# Altium schematic sheet RPI-CM3.SchDoc: PRI-CM-3
size 558 x 431 mm
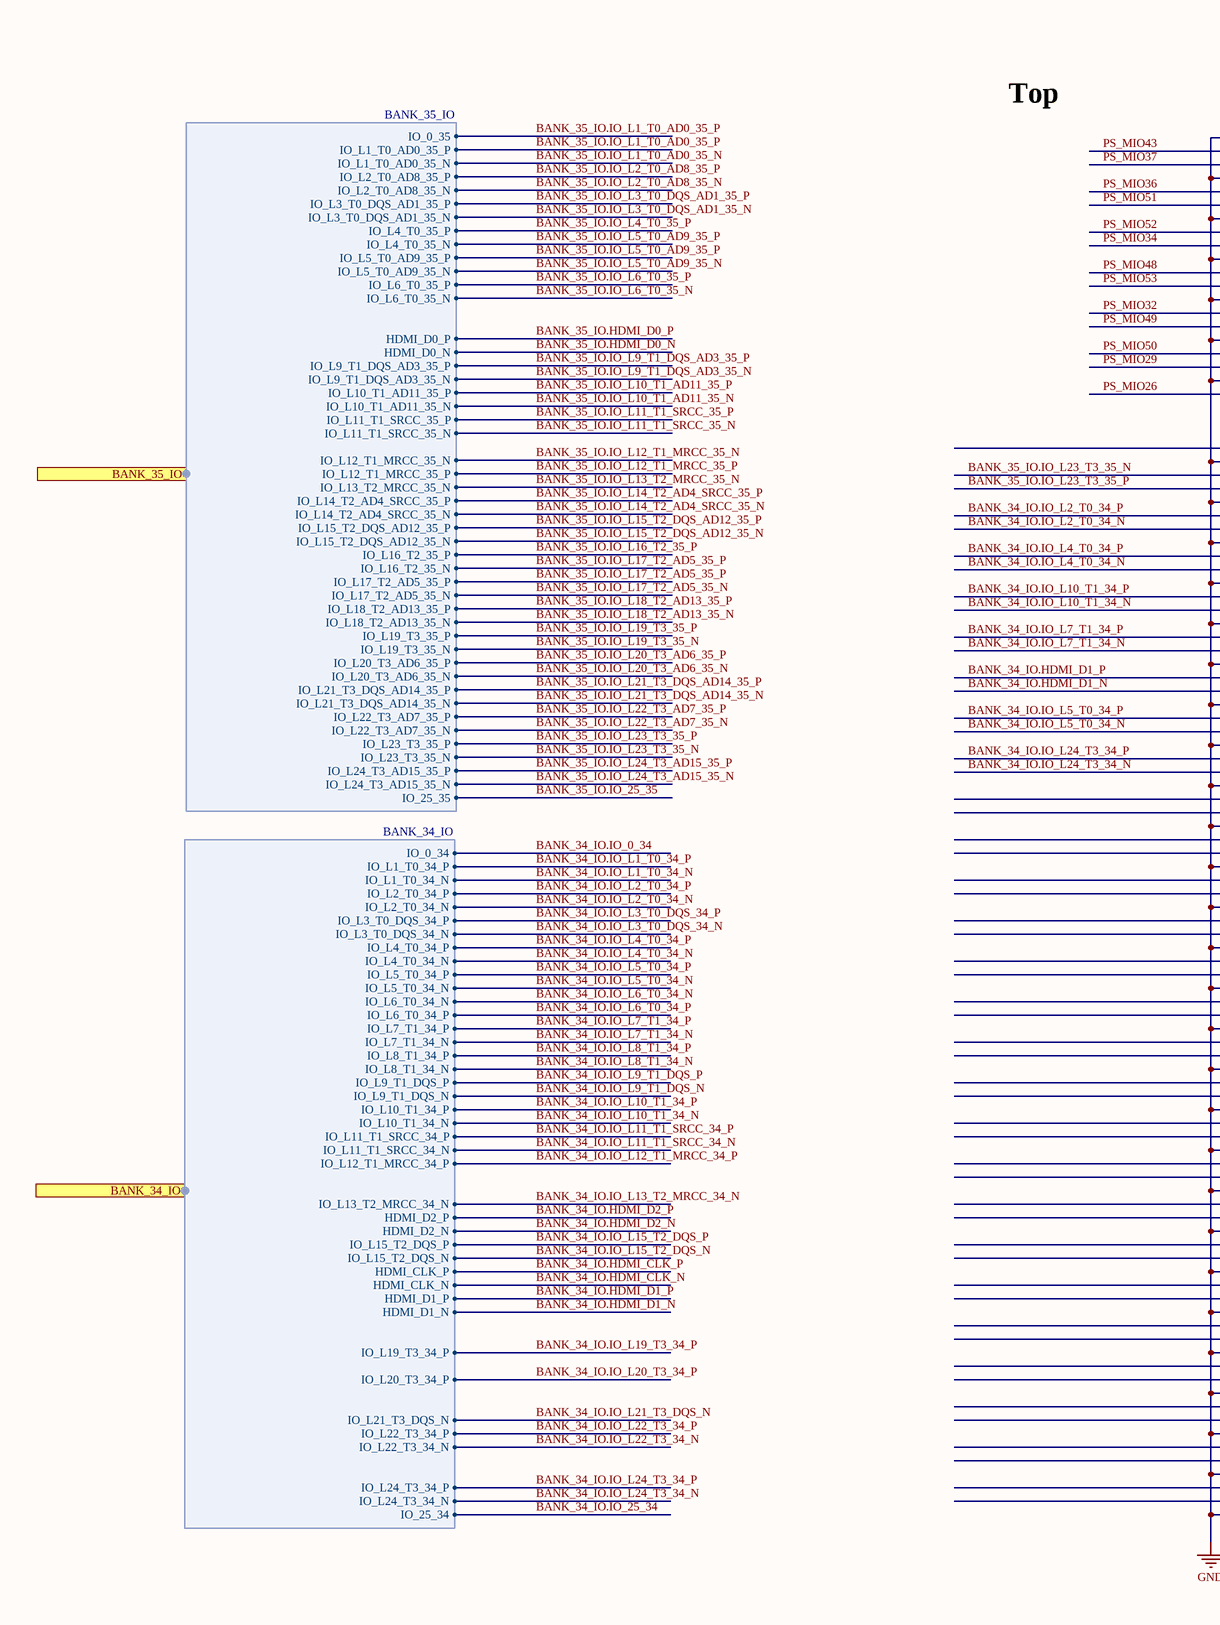
[diagram p0: RPI-CM3.SchDoc, left]
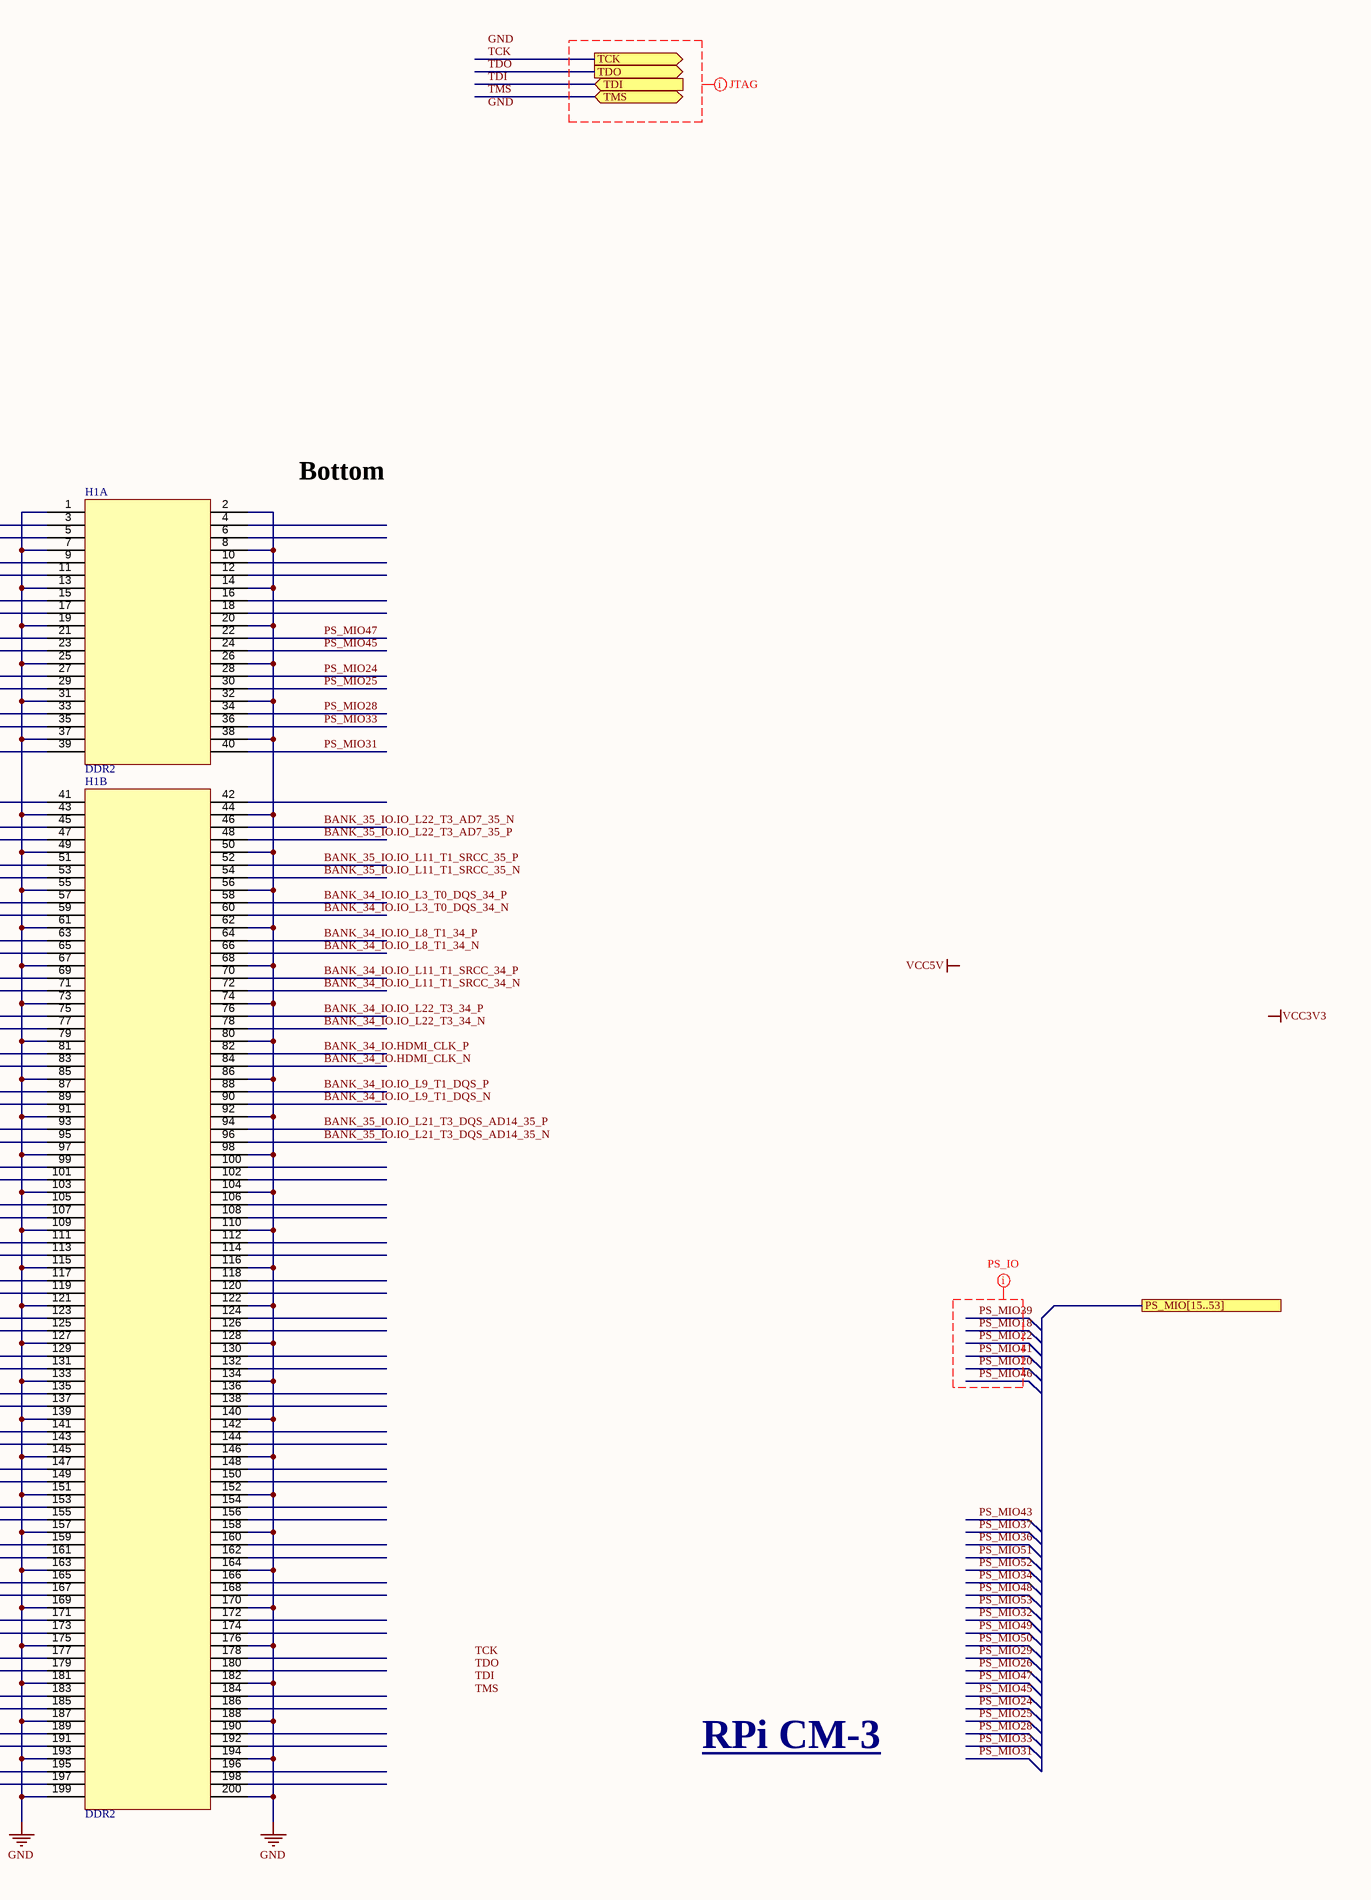
[diagram p1: RPI-CM3.SchDoc, right]

## Parts
H1  DDR2  [DDR2-SO-DIMM]  (parts A,B of 2)  (no BOM)

## Ports
BANK_34_IO (harness BANK_34_IO), BANK_35_IO (harness BANK_35_IO), PS_MIO[15..53], TCK (out), TDI (in), TDO (out), TMS (bidir)

## Harnesses
BANK_35_IO: IO_0_35, IO_L1_T0_AD0_35_P, IO_L1_T0_AD0_35_N, IO_L2_T0_AD8_35_P, IO_L2_T0_AD8_35_N, IO_L3_T0_DQS_AD1_35_P, IO_L3_T0_DQS_AD1_35_N, IO_L4_T0_35_P, IO_L4_T0_35_N, IO_L5_T0_AD9_35_P, IO_L5_T0_AD9_35_N, IO_L6_T0_35_P, IO_L6_T0_35_N, HDMI_D0_P, HDMI_D0_N, IO_L9_T1_DQS_AD3_35_P, IO_L9_T1_DQS_AD3_35_N, IO_L10_T1_AD11_35_P, IO_L10_T1_AD11_35_N, IO_L11_T1_SRCC_35_P, IO_L11_T1_SRCC_35_N, IO_L12_T1_MRCC_35_N, IO_L12_T1_MRCC_35_P, IO_L13_T2_MRCC_35_N, IO_L14_T2_AD4_SRCC_35_P, IO_L14_T2_AD4_SRCC_35_N, IO_L15_T2_DQS_AD12_35_P, IO_L15_T2_DQS_AD12_35_N, IO_L16_T2_35_P, IO_L16_T2_35_N, IO_L17_T2_AD5_35_P, IO_L17_T2_AD5_35_N, IO_L18_T2_AD13_35_P, IO_L18_T2_AD13_35_N, IO_L19_T3_35_P, IO_L19_T3_35_N, IO_L20_T3_AD6_35_P, IO_L20_T3_AD6_35_N, IO_L21_T3_DQS_AD14_35_P, IO_L21_T3_DQS_AD14_35_N, IO_L22_T3_AD7_35_P, IO_L22_T3_AD7_35_N, IO_L23_T3_35_P, IO_L23_T3_35_N, IO_L24_T3_AD15_35_P, IO_L24_T3_AD15_35_N, IO_25_35
BANK_34_IO: IO_0_34, IO_L1_T0_34_P, IO_L1_T0_34_N, IO_L2_T0_34_P, IO_L2_T0_34_N, IO_L3_T0_DQS_34_P, IO_L3_T0_DQS_34_N, IO_L4_T0_34_P, IO_L4_T0_34_N, IO_L5_T0_34_P, IO_L5_T0_34_N, IO_L6_T0_34_N, IO_L6_T0_34_P, IO_L7_T1_34_P, IO_L7_T1_34_N, IO_L8_T1_34_P, IO_L8_T1_34_N, IO_L9_T1_DQS_P, IO_L9_T1_DQS_N, IO_L10_T1_34_P, IO_L10_T1_34_N, IO_L11_T1_SRCC_34_P, IO_L11_T1_SRCC_34_N, IO_L12_T1_MRCC_34_P, IO_L13_T2_MRCC_34_N, HDMI_D2_P, HDMI_D2_N, IO_L15_T2_DQS_P, IO_L15_T2_DQS_N, HDMI_CLK_P, HDMI_CLK_N, HDMI_D1_P, HDMI_D1_N, IO_L19_T3_34_P, IO_L20_T3_34_P, IO_L21_T3_DQS_N, IO_L22_T3_34_P, IO_L22_T3_34_N, IO_L24_T3_34_P, IO_L24_T3_34_N, IO_25_34

## Nets
GND: H1.1 H1.2 H1.7 H1.8 H1.13 H1.14 H1.19 H1.20 H1.25 H1.26 H1.31 H1.32 H1.37 H1.38 H1.43 H1.44 H1.49 H1.50 H1.55 H1.56 H1.61 H1.62 H1.67 H1.68 H1.73 H1.74 H1.79 H1.80 H1.85 H1.86 H1.91 H1.92 H1.97 H1.98 H1.103 H1.104 H1.109 H1.110 H1.115 H1.116 H1.121 H1.122 H1.127 H1.128 H1.133 H1.134 H1.139 H1.140 H1.145 H1.146 H1.151 H1.152 H1.157 H1.158 H1.163 H1.164 H1.169 H1.170 H1.175 H1.176 H1.181 H1.182 H1.187 H1.188 H1.193 H1.194 H1.199 H1.200
BANK_34_IO.HDMI_CLK_N: H1.84 ; port BANK_34_IO.HDMI_CLK_N
BANK_34_IO.HDMI_CLK_P: H1.82 ; port BANK_34_IO.HDMI_CLK_P
BANK_34_IO.HDMI_D1_N: H1.77 ; port BANK_34_IO.HDMI_D1_N
BANK_34_IO.HDMI_D1_P: H1.75 ; port BANK_34_IO.HDMI_D1_P
BANK_34_IO.HDMI_D2_N: port BANK_34_IO.HDMI_D2_N
BANK_34_IO.HDMI_D2_P: port BANK_34_IO.HDMI_D2_P
BANK_34_IO.IO_0_34: port BANK_34_IO.IO_0_34
BANK_34_IO.IO_25_34: port BANK_34_IO.IO_25_34
BANK_34_IO.IO_L1_T0_34_N: port BANK_34_IO.IO_L1_T0_34_N
BANK_34_IO.IO_L1_T0_34_P: port BANK_34_IO.IO_L1_T0_34_P
BANK_34_IO.IO_L2_T0_34_N: H1.53 ; port BANK_34_IO.IO_L2_T0_34_N
BANK_34_IO.IO_L2_T0_34_P: H1.51 ; port BANK_34_IO.IO_L2_T0_34_P
BANK_34_IO.IO_L3_T0_DQS_34_N: H1.60 ; port BANK_34_IO.IO_L3_T0_DQS_34_N
BANK_34_IO.IO_L3_T0_DQS_34_P: H1.58 ; port BANK_34_IO.IO_L3_T0_DQS_34_P
BANK_34_IO.IO_L4_T0_34_N: H1.59 ; port BANK_34_IO.IO_L4_T0_34_N
BANK_34_IO.IO_L4_T0_34_P: H1.57 ; port BANK_34_IO.IO_L4_T0_34_P
BANK_34_IO.IO_L5_T0_34_N: H1.83 ; port BANK_34_IO.IO_L5_T0_34_N
BANK_34_IO.IO_L5_T0_34_P: H1.81 ; port BANK_34_IO.IO_L5_T0_34_P
BANK_34_IO.IO_L6_T0_34_N: port BANK_34_IO.IO_L6_T0_34_N
BANK_34_IO.IO_L6_T0_34_P: port BANK_34_IO.IO_L6_T0_34_P
BANK_34_IO.IO_L7_T1_34_N: H1.71 ; port BANK_34_IO.IO_L7_T1_34_N
BANK_34_IO.IO_L7_T1_34_P: H1.69 ; port BANK_34_IO.IO_L7_T1_34_P
BANK_34_IO.IO_L8_T1_34_N: H1.66 ; port BANK_34_IO.IO_L8_T1_34_N
BANK_34_IO.IO_L8_T1_34_P: H1.64 ; port BANK_34_IO.IO_L8_T1_34_P
BANK_34_IO.IO_L9_T1_DQS_N: H1.90 ; port BANK_34_IO.IO_L9_T1_DQS_N
BANK_34_IO.IO_L9_T1_DQS_P: H1.88 ; port BANK_34_IO.IO_L9_T1_DQS_P
BANK_34_IO.IO_L10_T1_34_N: H1.65 ; port BANK_34_IO.IO_L10_T1_34_N
BANK_34_IO.IO_L10_T1_34_P: H1.63 ; port BANK_34_IO.IO_L10_T1_34_P
BANK_34_IO.IO_L11_T1_SRCC_34_N: H1.72 ; port BANK_34_IO.IO_L11_T1_SRCC_34_N
BANK_34_IO.IO_L11_T1_SRCC_34_P: H1.70 ; port BANK_34_IO.IO_L11_T1_SRCC_34_P
BANK_34_IO.IO_L12_T1_MRCC_34_P: port BANK_34_IO.IO_L12_T1_MRCC_34_P
BANK_34_IO.IO_L13_T2_MRCC_34_N: port BANK_34_IO.IO_L13_T2_MRCC_34_N
BANK_34_IO.IO_L15_T2_DQS_N: port BANK_34_IO.IO_L15_T2_DQS_N
BANK_34_IO.IO_L15_T2_DQS_P: port BANK_34_IO.IO_L15_T2_DQS_P
BANK_34_IO.IO_L19_T3_34_P: port BANK_34_IO.IO_L19_T3_34_P
BANK_34_IO.IO_L20_T3_34_P: port BANK_34_IO.IO_L20_T3_34_P
BANK_34_IO.IO_L21_T3_DQS_N: port BANK_34_IO.IO_L21_T3_DQS_N
BANK_34_IO.IO_L22_T3_34_N: H1.78 ; port BANK_34_IO.IO_L22_T3_34_N
BANK_34_IO.IO_L22_T3_34_P: H1.76 ; port BANK_34_IO.IO_L22_T3_34_P
BANK_34_IO.IO_L24_T3_34_N: H1.89 ; port BANK_34_IO.IO_L24_T3_34_N
BANK_34_IO.IO_L24_T3_34_P: H1.87 ; port BANK_34_IO.IO_L24_T3_34_P
BANK_35_IO.HDMI_D0_N: port BANK_35_IO.HDMI_D0_N
BANK_35_IO.HDMI_D0_P: port BANK_35_IO.HDMI_D0_P
BANK_35_IO.IO_25_35: port BANK_35_IO.IO_25_35
BANK_35_IO.IO_L1_T0_AD0_35_N: port BANK_35_IO.IO_L1_T0_AD0_35_N
BANK_35_IO.IO_L1_T0_AD0_35_P: port BANK_35_IO.IO_0_35, port BANK_35_IO.IO_L1_T0_AD0_35_P
BANK_35_IO.IO_L2_T0_AD8_35_N: port BANK_35_IO.IO_L2_T0_AD8_35_N
BANK_35_IO.IO_L2_T0_AD8_35_P: port BANK_35_IO.IO_L2_T0_AD8_35_P
BANK_35_IO.IO_L3_T0_DQS_AD1_35_N: port BANK_35_IO.IO_L3_T0_DQS_AD1_35_N
BANK_35_IO.IO_L3_T0_DQS_AD1_35_P: port BANK_35_IO.IO_L3_T0_DQS_AD1_35_P
BANK_35_IO.IO_L4_T0_35_P: port BANK_35_IO.IO_L4_T0_35_P
BANK_35_IO.IO_L5_T0_AD9_35_N: port BANK_35_IO.IO_L5_T0_AD9_35_N
BANK_35_IO.IO_L5_T0_AD9_35_P: port BANK_35_IO.IO_L4_T0_35_N, port BANK_35_IO.IO_L5_T0_AD9_35_P
BANK_35_IO.IO_L6_T0_35_N: port BANK_35_IO.IO_L6_T0_35_N
BANK_35_IO.IO_L6_T0_35_P: port BANK_35_IO.IO_L6_T0_35_P
BANK_35_IO.IO_L9_T1_DQS_AD3_35_N: port BANK_35_IO.IO_L9_T1_DQS_AD3_35_N
BANK_35_IO.IO_L9_T1_DQS_AD3_35_P: port BANK_35_IO.IO_L9_T1_DQS_AD3_35_P
BANK_35_IO.IO_L10_T1_AD11_35_N: port BANK_35_IO.IO_L10_T1_AD11_35_N
BANK_35_IO.IO_L10_T1_AD11_35_P: port BANK_35_IO.IO_L10_T1_AD11_35_P
BANK_35_IO.IO_L11_T1_SRCC_35_N: H1.54 ; port BANK_35_IO.IO_L11_T1_SRCC_35_N
BANK_35_IO.IO_L11_T1_SRCC_35_P: H1.52 ; port BANK_35_IO.IO_L11_T1_SRCC_35_P
BANK_35_IO.IO_L12_T1_MRCC_35_N: port BANK_35_IO.IO_L12_T1_MRCC_35_N
BANK_35_IO.IO_L12_T1_MRCC_35_P: port BANK_35_IO.IO_L12_T1_MRCC_35_P
BANK_35_IO.IO_L13_T2_MRCC_35_N: port BANK_35_IO.IO_L13_T2_MRCC_35_N
BANK_35_IO.IO_L14_T2_AD4_SRCC_35_N: port BANK_35_IO.IO_L14_T2_AD4_SRCC_35_N
BANK_35_IO.IO_L14_T2_AD4_SRCC_35_P: port BANK_35_IO.IO_L14_T2_AD4_SRCC_35_P
BANK_35_IO.IO_L15_T2_DQS_AD12_35_N: port BANK_35_IO.IO_L15_T2_DQS_AD12_35_N
BANK_35_IO.IO_L15_T2_DQS_AD12_35_P: port BANK_35_IO.IO_L15_T2_DQS_AD12_35_P
BANK_35_IO.IO_L16_T2_35_P: port BANK_35_IO.IO_L16_T2_35_P
BANK_35_IO.IO_L17_T2_AD5_35_N: port BANK_35_IO.IO_L17_T2_AD5_35_N
BANK_35_IO.IO_L17_T2_AD5_35_P: port BANK_35_IO.IO_L16_T2_35_N, port BANK_35_IO.IO_L17_T2_AD5_35_P
BANK_35_IO.IO_L18_T2_AD13_35_N: port BANK_35_IO.IO_L18_T2_AD13_35_N
BANK_35_IO.IO_L18_T2_AD13_35_P: port BANK_35_IO.IO_L18_T2_AD13_35_P
BANK_35_IO.IO_L19_T3_35_N: port BANK_35_IO.IO_L19_T3_35_N
BANK_35_IO.IO_L19_T3_35_P: port BANK_35_IO.IO_L19_T3_35_P
BANK_35_IO.IO_L20_T3_AD6_35_N: port BANK_35_IO.IO_L20_T3_AD6_35_N
BANK_35_IO.IO_L20_T3_AD6_35_P: port BANK_35_IO.IO_L20_T3_AD6_35_P
BANK_35_IO.IO_L21_T3_DQS_AD14_35_N: H1.96 ; port BANK_35_IO.IO_L21_T3_DQS_AD14_35_N
BANK_35_IO.IO_L21_T3_DQS_AD14_35_P: H1.94 ; port BANK_35_IO.IO_L21_T3_DQS_AD14_35_P
BANK_35_IO.IO_L22_T3_AD7_35_N: H1.46 ; port BANK_35_IO.IO_L22_T3_AD7_35_N
BANK_35_IO.IO_L22_T3_AD7_35_P: H1.48 ; port BANK_35_IO.IO_L22_T3_AD7_35_P
BANK_35_IO.IO_L23_T3_35_N: H1.45 ; port BANK_35_IO.IO_L23_T3_35_N
BANK_35_IO.IO_L23_T3_35_P: H1.47 ; port BANK_35_IO.IO_L23_T3_35_P
BANK_35_IO.IO_L24_T3_AD15_35_N: port BANK_35_IO.IO_L24_T3_AD15_35_N
BANK_35_IO.IO_L24_T3_AD15_35_P: port BANK_35_IO.IO_L24_T3_AD15_35_P
PS_MIO24: H1.28
PS_MIO25: H1.30
PS_MIO26: H1.39
PS_MIO28: H1.34
PS_MIO29: H1.35
PS_MIO31: H1.40
PS_MIO32: H1.27
PS_MIO33: H1.36
PS_MIO34: H1.17
PS_MIO36: H1.9
PS_MIO37: H1.5
PS_MIO43: H1.3
PS_MIO45: H1.24
PS_MIO47: H1.22
PS_MIO48: H1.21
PS_MIO49: H1.29
PS_MIO50: H1.33
PS_MIO51: H1.11
PS_MIO52: H1.15
PS_MIO53: H1.23
TCK: port TCK
TDI: port TDI
TDO: port TDO
TMS: port TMS

Not connected (* = marked no-connect by the designer): H1 4 6 10 12 16 18 41 42 93 95 99 100 101 102 105 106 107 108 111 112 113 114 117 118 119 120 123 124 125 126 129 130 131 132 135 136 137 138 141 142 143 144 147 148 149 150 153 154 155 156 159 160 161 162 165 166 167 168 171 172 173 174 177 178 179 180 183 184 185 186 189 190 191 192 195 196 197 198

## Layout directives
mark named PS_IO: PS_MIO18, PS_MIO20, PS_MIO22, PS_MIO39, PS_MIO41, PS_MIO46
net class JTAG: (no net found under the mark)

## Notes on the sheet
- Top
- Bottom
- RPi CM-3 <https://www.bing.com/ck/a?!&&p=74f46bbfaa6c12b2JmltdHM9MTcwNjA1NDQwMCZpZ3VpZD0zNDU3Zjg5Ni0xN2Y3LTZjMGEtMGJlMy1lYjczMTZhMDZkZWImaW5zaWQ9NTI1NA&ptn=3&ver=2&hsh=3&fclid=3457f896-17f7-6c0a-0be3-eb7316a06deb&psq=raspberry+pi+compute+module+3+schematic&u=a1aHR0cHM6Ly9kYXRhc2hlZXRzLnJhc3BiZXJyeXBpLmNvbS9jbS9jbhttps://www.bing.com/ck/a?!&&p=74f46bbfaa6c12b2JmltdHM9MTcwNjA1NDQwMCZpZ3VpZD0zNDU3Zjg5Ni0xN2Y3LTZjMGEtMGJlMy1lYjczMTZhMDZkZWImaW5zaWQ9NTI1NA&ptn=3&ver=2&hsh=3&fclid=3457f896-17f7-6c0a-0be3-eb7316a06deb&psq=raspberry+pi+compute+module+3+schematic&u=a1aHR0cHM6Ly9kYXRhc2hlZXRzLnJhc3BiZXJyeXBpLmNvbS9jbS9jbTMtc2NoZW1hdGljcy5wZGY&ntb=1TMtc2NoZW1hdGljcy5wZGY&ntb=1>
- Labels drawn without touching a wire or pin: GND, TCK, TDI, TDO, TMS, VCC3V3, VCC5V
- DWG. NO.
- REV.
- SHT.
- REVISION
- DESCRIPTION
- DATE
- APPROVED
- THIS DOCUMENT AND THE DATA DISCLOSED HEREIN OR HEREWITH IS THE PROPERTY OF ALTIUM LIMITED AND MAY BE FREELY DISTRIBUTED IN WHOLE. NO RIGHTS ARE RESERVED OR EXPRESS OR IMPLIED WARANTEE GIVEN.
- ENG:
- DSN:
- APPROVALS
- CHK:
- BOM:
- REFERENCE DOCUMENTS
- FAB DWG:
- PCB DWG:
- ASSY DWG:
- Date:
- SIZE
- C
- Ver:
- FILE NAME
- DWG NO.
- SHEET
- OF
- REV

## Library data of the parts
H1 = DDR2_SODIMM